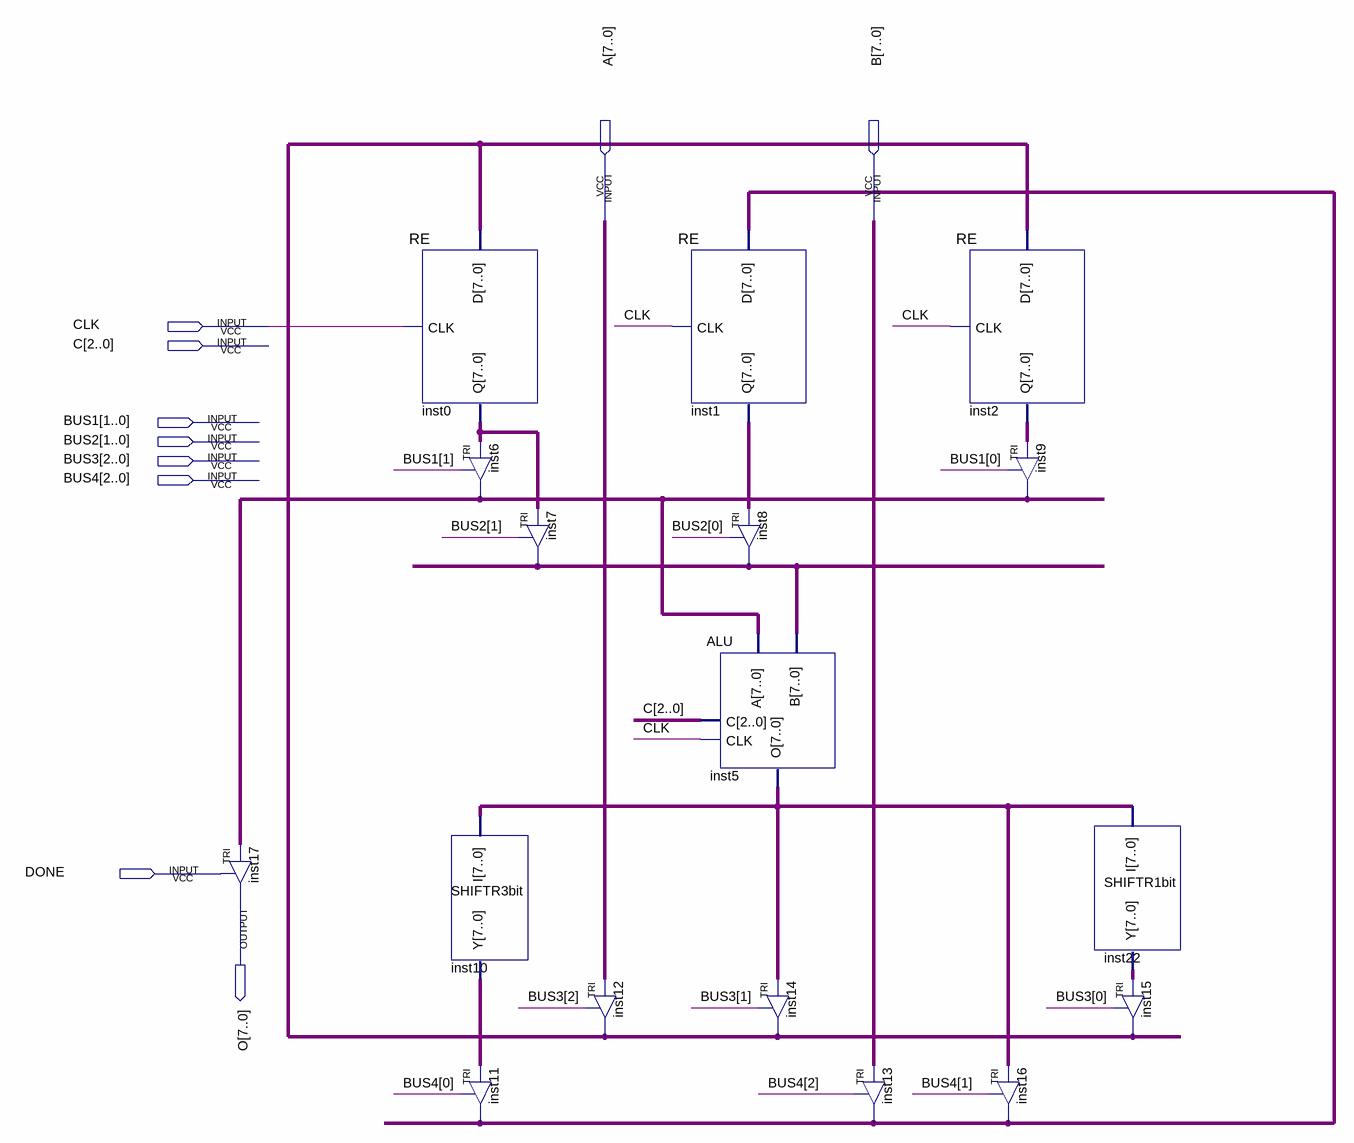
[diagram p0: schematic sheet]
// Quartus schematic pipilene.bdf as structural Verilog: 17 symbols, 10 pins
module pipilene (
  input  [7:0] A,
  input  [7:0] B,
  input  CLK,
  input  [2:0] C,
  input  [1:0] BUS1,
  input  [1:0] BUS2,
  input  [2:0] BUS3,
  input  [2:0] BUS4,
  input  DONE,
  output [7:0] O
);

  wire [7:0] inst0_q, inst1_q, inst2_q, inst5_o, inst6_out, inst7_out, inst10_y, inst11_out, inst12_out,
       inst22_y;

  TRI inst17[7:0] (.IN(inst6_out), .OE(DONE), .OUT(O));
  RE inst0 (.D(inst12_out), .CLK(CLK), .Q(inst0_q));
  TRI inst6[7:0] (.IN(inst0_q), .OE(BUS1[1]), .OUT(inst6_out));
  SHIFTR3bit inst10 (.I(inst5_o), .Y(inst10_y));
  TRI inst11[7:0] (.IN(inst10_y), .OE(BUS4[0]), .OUT(inst11_out));
  TRI inst7[7:0] (.IN(inst0_q), .OE(BUS2[1]), .OUT(inst7_out));
  TRI inst12[7:0] (.IN(A), .OE(BUS3[2]), .OUT(inst12_out));
  RE inst1 (.D(inst11_out), .CLK(CLK), .Q(inst1_q));
  ALU inst5 (.A(inst6_out), .B(inst7_out), .C(C), .CLK(CLK), .O(inst5_o));
  TRI inst8[7:0] (.IN(inst1_q), .OE(BUS2[0]), .OUT(inst7_out));
  TRI inst14[7:0] (.IN(inst5_o), .OE(BUS3[1]), .OUT(inst12_out));
  TRI inst13[7:0] (.IN(B), .OE(BUS4[2]), .OUT(inst11_out));
  RE inst2 (.D(inst12_out), .CLK(CLK), .Q(inst2_q));
  TRI inst9[7:0] (.IN(inst2_q), .OE(BUS1[0]), .OUT(inst6_out));
  TRI inst16[7:0] (.IN(inst5_o), .OE(BUS4[1]), .OUT(inst11_out));
  SHIFTR1bit inst22 (.I(inst5_o), .Y(inst22_y));
  TRI inst15[7:0] (.IN(inst22_y), .OE(BUS3[0]), .OUT(inst12_out));
endmodule
